# Altium project Pedal_SD_USB.PrjPcb
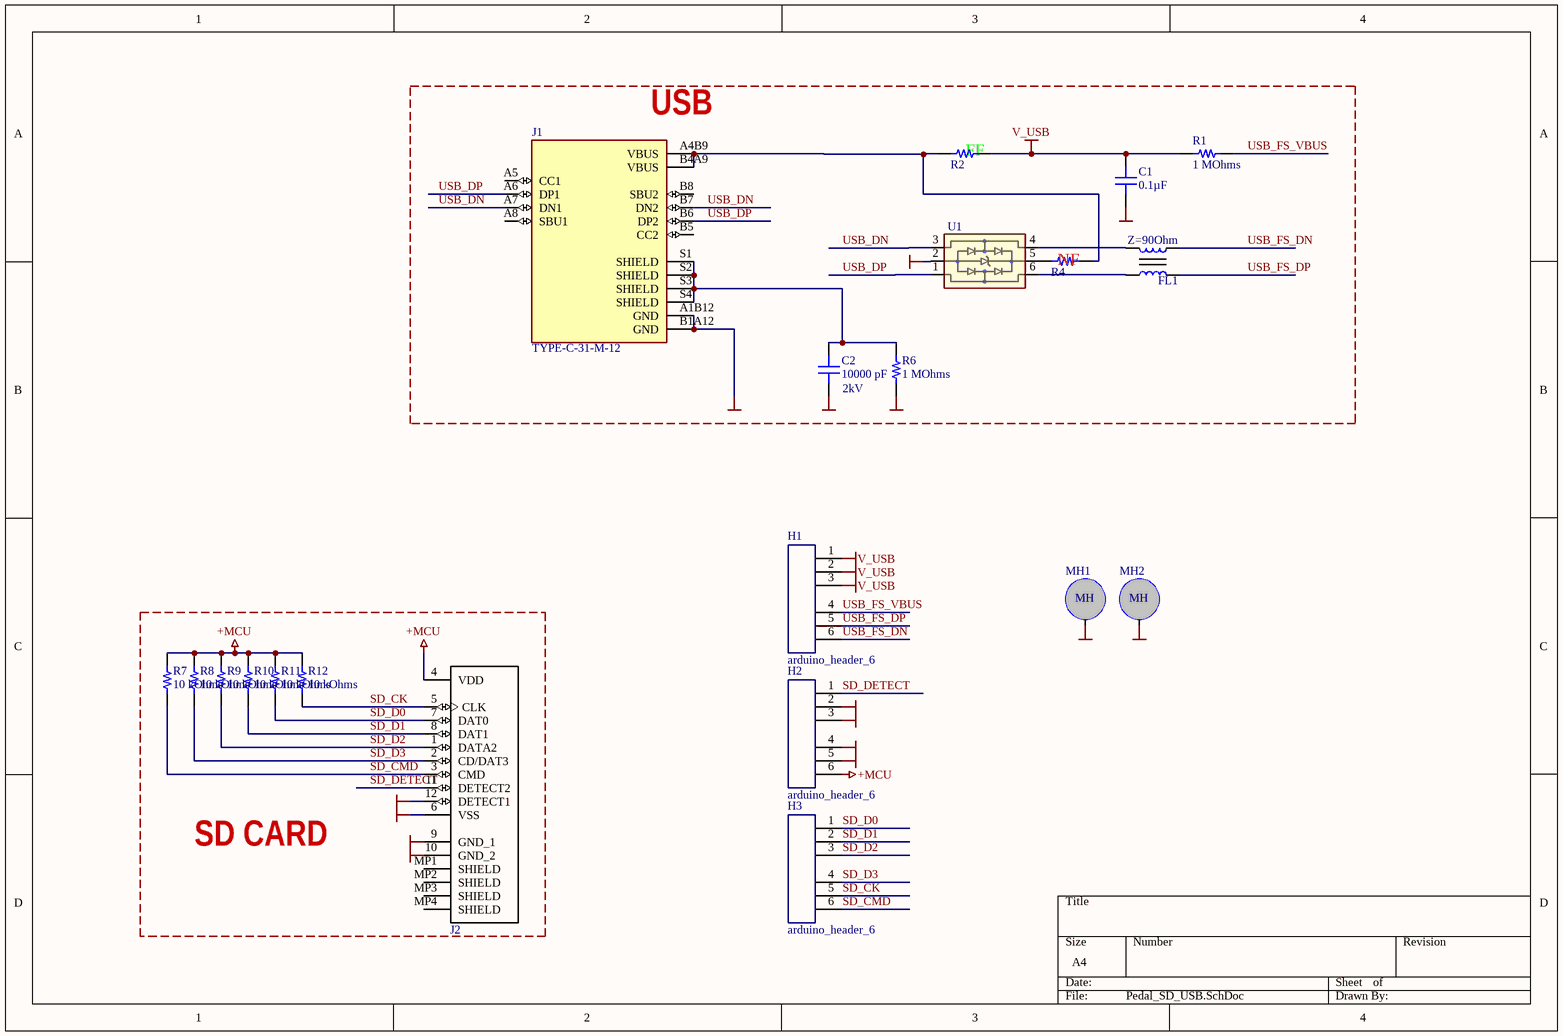
[diagram p0: Pedal_SD_USB.SchDoc]
1 sheet, 21 parts. Net scope: global (net labels, ports and power ports of the same name join across sheets).
Board file: Pedal_SD_USB.PcbDoc

## Sheet Pedal_SD_USB.SchDoc
size A4; SheetNumber: 1; SheetTotal: 1

### Parts
C1  0.1µF  [CAP 0402_1005]
C2  10000 pF  [CAP 1210_3225 - 1MM]
FL1  Z=90Ohm  [FIL_ACM2012-361-2P-T002]
H1  arduino_header_6  [header-6_male]
H2  arduino_header_6  [header-6_male]
H3  arduino_header_6  [header-6_male]
J1  TYPE-C-31-M-12  [HRO_TYPE-C-31-M-12 - REZONIT]
J2  SCHA4B0400  [SCHA4B0400]  (value not drawn)
MH1  MountingHole  [Hole_2.5mm]  (value not drawn)
MH2  MountingHole  [Hole_2.5mm]  (value not drawn)
R1  value 1 MOhms  [RES 0603_1608]
R2  (no value)  [RES 0603_1608]
R4  (no value)  [RES 0603_1608]
R6  1 MOhms  [RES 0603_1608]
R7  10 kOhms  [RES 0603_1608]
R8  10 kOhms  [RES 0603_1608]
R9  10 kOhms  [RES 0603_1608]
R10  10 kOhms  [RES 0603_1608]
R11  10 kOhms  [RES 0603_1608]
R12  10 kOhms  [RES 0603_1608]
U1  (no value)  [SOT-666]

### Blocks framed on the sheet
USB: C1 C2 FL1 J1 R1 R2 R4 R6 U1
SD CARD: J2 R7-R12

### Nets
+MCU: H2.6 J2.4(VDD) R7.2 R8.2 R9.2 R10.2 R11.2 R12.2
GND: C1.1 C2.1 H2.2 H2.3 H2.4 H2.5 J1.A1B12(GND) J1.B1A12(GND) J2.6(VSS) J2.9(GND_1) J2.10(GND_2) J2.12(DETECT1) MH1.0 MH2.0 R6.1 U1.2
V_USB: C1.2 H1.1 H1.2 H1.3 R1.2 R2.1
SD_CK: H3.5 J2.5(CLK) R12.1
SD_CMD: H3.6 J2.3(CMD) R7.1
SD_D0: H3.1 J2.7(DAT0) R11.1
SD_D1: H3.2 J2.8(DAT1) R10.1
SD_D2: H3.3 J2.1(DATA2) R9.1
SD_D3: H3.4 J2.2(CD/DAT3) R8.1
SD_DETECT: H2.1 J2.11(DETECT2)
USB_DN: J1.A7(DN1) J1.B7(DN2) U1.3
USB_DP: J1.A6(DP1) J1.B6(DP2) U1.1
USB_FS_DN: FL1.3 H1.6
USB_FS_DP: FL1.4 H1.5
USB_FS_VBUS: H1.4 R1.1
NetC2_2: C2.2 J1.S1(SHIELD) J1.S2(SHIELD) J1.S3(SHIELD) J1.S4(SHIELD) R6.2
NetFL1_1: FL1.1 U1.6
NetFL1_2: FL1.2 U1.4
NetJ1_A4B9: J1.A4B9(VBUS) J1.B4A9(VBUS) R2.2 R4.1
NetR4_2: R4.2 U1.5

Not connected (* = marked no-connect by the designer): J1 A5(CC1) A8(SBU1) B5(CC2) B8(SBU2); J2 MP1(SHIELD) MP2(SHIELD) MP3(SHIELD) MP4(SHIELD)

### Notes on the sheet
- (near R2) FF
- (near R4) NF
- (near C2) 2kV
- (in symbol MountingHole) MH

### Library data of the parts
C1 = C0402C104K4RACAUTO: CAP CER 0.1UF 16V X7R 0402; Manufacturer: KEMET; Tolerance: ±10%; Part Number: C0402C104K4RACAUTO; Value: 0.1µF; Applications: Automotive, Bypass, Decoupling; Capacitance: 0.1µF; ComponentLink1Description: Datasheet; ComponentLink1URL: https://api.kemet.com/component-edge/download/specsheet/C0402C104K4RACAUTO.pdf; ComponentLink2Description: DigiKey Link; ComponentLink2URL: http://digikey.com/product-detail/en/kemet/C0402C104K4RACAUTO/399-6828-1-ND/3314343; Device Package: 0402 (1005 Metric); LastUpdated: 9/2/2020 1:02:21 AM; Lifecycle Status: Active; Minimum Order: 1; Mounting Type: Surface Mount, MLCC; Operating Temperature: -55°C ~ 125°C; Package / Case: 0402 (1005 Metric); Packaging: TapeAndReel; PartId: 3024; Part Status: Active; Price: 0.01; Ratings: AEC-Q200; Series: SMD Auto X7R; Size / Dimension: 0.039" L x 0.020" W (1.00mm x 0.50mm); Supplier 1: DigiKey; Supplier Part Number 1: 399-6828-1-ND; Temperature Coefficient: X7R; Thickness (Max): 0.022" (0.55mm); Voltage - Rated: 16V
C2 = C1210C103KDRAC7800: CAP CER 10000PF 1KV X7R 1210; manufacturer: KEMET; Tolerance: ±10%; Voltage - Rated: 1000V (1kV); Part Number: C1210C103KDRAC7800; Value: 10000 pF; Applications: General Purpose; Capacitance: 10000 pF; componentlink1description: Datasheet; componentlink1url: https://api.kemet.com/component-edge/download/datasheet/C1210C103KDRACTU.pdf; componentlink2description: DigiKey Link; componentlink2url: https://www.digikey.com/en/products/detail/kemet/C1210C103KDRAC7800/2216434; Device Package: 1210 (3225 Metric); Features: Low ESL, High Voltage; lastupdated: 9/16/2023 7:34:43 PM; Lifecycle Status: Active; Minimum Order: 1; Mounting Type: Surface Mount, MLCC; Operating Temperature: -55°C ~ 125°C; Package / Case: 1210 (3225 Metric); packaging: TapeAndReel; partid: 29443; Part Status: Active; price: 0.09; series: SMD Comm X7R HV; Size / Dimension: 0.126" L x 0.098" W (3.20mm x 2.50mm); Supplier 1: DigiKey; Supplier Part Number 1: 399-C1210C103KDRAC7800CT-ND; Temperature Coefficient: X7R; Thickness (Max): 0.061" (1.55mm)
FL1 = ACM2012-361-2P-T002: ACM Series 0805 360 Ohm 220mA 500 mOhm DCR 50 V SMT Common Mode Filter; MF: TDK; MP: ACM2012-361-2P-T002; Price: 0.24 USD; Package: None; Availability: Good; Value: *
H1-H3 = arduino_header_6: System: Connector
J1 = TYPE-C-31-M-12: USB Connectors 24 Receptacle 1 8.94*7.3mm RoHS; MF: {'manufacturer': u'HRO Electronics Co., Ltd.'}; Package: None; Price: None; Value: *; MP: TYPE-C-31-M-12; Availability: Unavailable
J2 = SCHA4B0400: SD card Connector; Manufacturer_Name: ALPS Electric; Datasheet Link: https://br.mouser.com/datasheet/2/15/SCHA-1155938.pdf; Height: 1.29mm; Manufacturer_Part_Number: SCHA4B0400; Mouser Part Number: 688-SCHA4B0400; Mouser Price/Stock: https://www.mouser.com/Search/Refine.aspx?Keyword=688-SCHA4B0400
R1 R6 = ERJ-3EKF1004V: RES SMD 1M OHM 1% 1/10W 0603; Manufacturer: Panasonic Electronic Components; Power (Watts): 0.1W, 1/10W; Temperature Coefficient: ±100ppm/°C; Part Number: ERJ-3EKF1004V; ComponentLink1Description: Datasheet; ComponentLink1URL: https://industrial.panasonic.com/cdbs/www-data/pdf/RDA0000/AOA0000C304.pdf; ComponentLink2Description: DigiKey Link; ComponentLink2URL: https://www.digikey.com/en/products/detail/panasonic-electronic-components/ERJ-3EKF1004V/196033; Composition: Thick Film; Device Package: 0603 (1608 Metric); Height - Seated (Max): 0.022" (0.55mm); LastUpdated: 2/9/2024 8:42:00 PM; Lifecycle Status: Active; Minimum Order: 1; Number of Terminations: 2; Operating Temperature: -55°C ~ 155°C; Package / Case: 0603 (1608 Metric); Packaging: TapeAndReel; PartId: 25691; Part Status: Active; Price: 0.01; Resistance: 1 MOhms; Series: ERJ-3EK; Size / Dimension: 0.063" L x 0.031" W (1.60mm x 0.80mm); Supplier 1: DigiKey; Supplier Part Number 1: P1.00MHCT-ND; Supplier Device Package: 0603; Tolerance: ±1%; Features: Automotive AEC-Q200; Ratings: AEC-Q200
  R6: Value: 1 MOhms
R2 R4 = RCA06030000ZSEA: RES SMD 0 OHM JUMPER 1/10W 0603; Manufacturer: Vishay Dale; Power (Watts): 0.1W, 1/10W; Part Number: RCA06030000ZSEA; ComponentLink1Description: Datasheet; ComponentLink1URL: http://www.vishay.com/docs/20037/rcae3.pdf; ComponentLink2Description: DigiKey Link; ComponentLink2URL: http://digikey.com/product-detail/en/vishay-dale/RCA06030000ZSEA/541-2192-1-ND/4946845; Composition: Thick Film; Device Package: 0603 (1608 Metric); Features: Anti-Sulfur, Automotive AEC-Q200; Height - Seated (Max): 0.020" (0.50mm); LastUpdated: 9/2/2020 1:10:23 AM; Lifecycle Status: Active; Minimum Order: 1; Number of Terminations: 2; Operating Temperature: -55°C ~ 155°C; Package / Case: 0603 (1608 Metric); Packaging: TapeAndReel; PartId: 5740; Part Status: Active; Price: 0.01; Ratings: AEC-Q200; Series: RCA; Size / Dimension: 0.061" L x 0.033" W (1.55mm x 0.85mm); Supplier 1: DigiKey; Supplier Part Number 1: 541-2192-1-ND; Supplier Device Package: 0603; Tolerance: Jumper
R7-R12 = ERJ-3EKF1002V: RES SMD 10K OHM 1% 1/10W 0603; Manufacturer: Panasonic Electronic Components; Power (Watts): 0.1W, 1/10W; Temperature Coefficient: ±100ppm/°C; Part Number: ERJ-3EKF1002V; Value: 10 kOhms; ComponentLink1Description: Datasheet; ComponentLink1URL: https://industrial.panasonic.com/cdbs/www-data/pdf/RDA0000/AOA0000C304.pdf; ComponentLink2Description: DigiKey Link; ComponentLink2URL: https://www.digikey.com/en/products/detail/panasonic-electronic-components/ERJ-3EKF1002V/196066; Composition: Thick Film; Device Package: 0603 (1608 Metric); Height - Seated (Max): 0.022" (0.55mm); LastUpdated: 2/9/2024 8:41:59 PM; Lifecycle Status: Active; Minimum Order: 1; Number of Terminations: 2; Operating Temperature: -55°C ~ 155°C; Package / Case: 0603 (1608 Metric); Packaging: TapeAndReel; PartId: 25695; Part Status: Active; Price: 0.01; Resistance: 10 kOhms; Series: ERJ-3EK; Size / Dimension: 0.063" L x 0.031" W (1.60mm x 0.80mm); Supplier 1: DigiKey; Supplier Part Number 1: P10.0KHCT-ND; Supplier Device Package: 0603; Tolerance: ±1%; Features: Automotive AEC-Q200; Ratings: AEC-Q200
U1 = USBLC6-2: Very Low Capacitance Esd Protection; MF: STMicroelectronics; Availability: Unavailable; Price: None; Package: SOT-563 STMicroelectronics; MP: USBLC6-2; Value: *; helpurl: https://lib.chipdip.ru/093/DOC001093117.pdf